# Altium schematic sheet Sheet.Autolabor.SchDoc
size A4
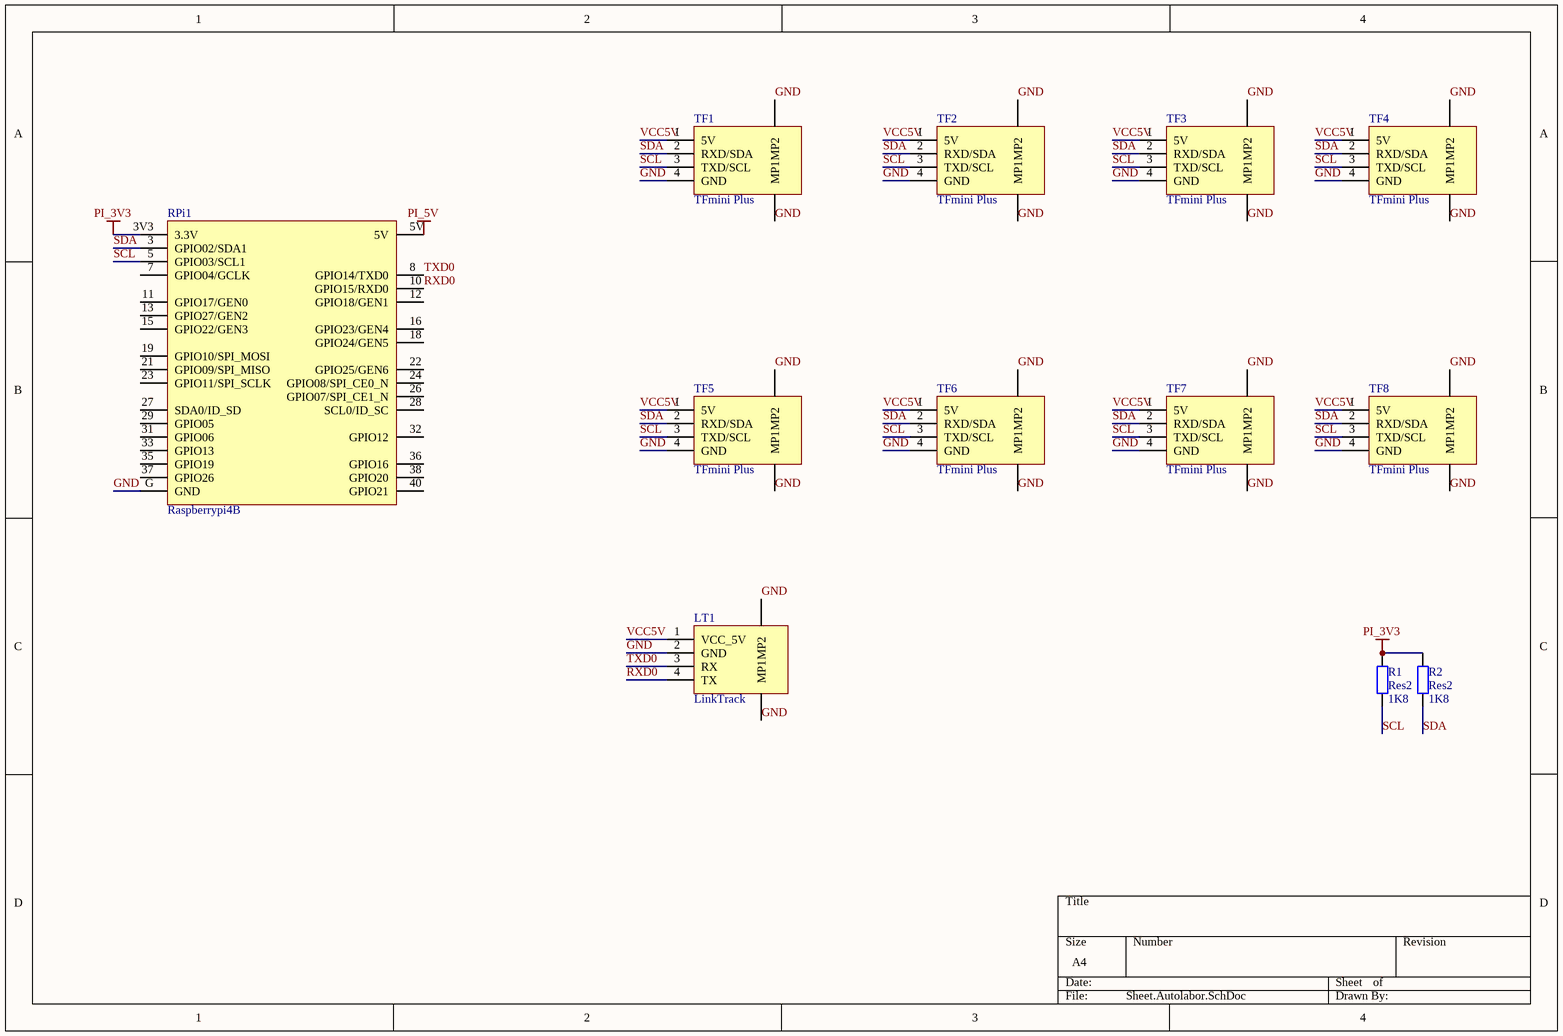
[diagram p0: Sheet.Autolabor.SchDoc]

## Parts
LT1  LinkTrack  [GH1.25-S-4P-small]
R1  Res2  value 1K8  [6-0805_L]
R2  Res2  value 1K8  [6-0805_L]
RPi1  Raspberrypi4B  [RPi-40p-small]
TF1  TFmini Plus  [GH1.25-S-4P-small]
TF2  TFmini Plus  [GH1.25-S-4P-small]
TF3  TFmini Plus  [GH1.25-S-4P-small]
TF4  TFmini Plus  [GH1.25-S-4P-small]
TF5  TFmini Plus  [GH1.25-S-4P-small]
TF6  TFmini Plus  [GH1.25-S-4P-small]
TF7  TFmini Plus  [GH1.25-S-4P-small]
TF8  TFmini Plus  [GH1.25-S-4P-small]

## Nets
PI_3V3: R1.2 R2.2 RPi1.3V3(3.3V)
PI_5V: RPi1.5V
GND: LT1.2(GND) LT1.MP1 LT1.MP2 RPi1.G(GND) TF1.4(GND) TF1.MP1 TF1.MP2 TF2.4(GND) TF2.MP1 TF2.MP2 TF3.4(GND) TF3.MP1 TF3.MP2 TF4.4(GND) TF4.MP1 TF4.MP2 TF5.4(GND) TF5.MP1 TF5.MP2 TF6.4(GND) TF6.MP1 TF6.MP2 TF7.4(GND) TF7.MP1 TF7.MP2 TF8.4(GND) TF8.MP1 TF8.MP2
RXD0: LT1.4(TX) RPi1.10(GPIO15/RXD0)
SCL: R1.1 RPi1.5(GPIO03/SCL1) TF1.3(TXD/SCL) TF2.3(TXD/SCL) TF3.3(TXD/SCL) TF4.3(TXD/SCL) TF5.3(TXD/SCL) TF6.3(TXD/SCL) TF7.3(TXD/SCL) TF8.3(TXD/SCL)
SDA: R2.1 RPi1.3(GPIO02/SDA1) TF1.2(RXD/SDA) TF2.2(RXD/SDA) TF3.2(RXD/SDA) TF4.2(RXD/SDA) TF5.2(RXD/SDA) TF6.2(RXD/SDA) TF7.2(RXD/SDA) TF8.2(RXD/SDA)
TXD0: LT1.3(RX) RPi1.8(GPIO14/TXD0)
VCC5V: LT1.1(VCC_5V) TF1.1(5V) TF2.1(5V) TF3.1(5V) TF4.1(5V) TF5.1(5V) TF6.1(5V) TF7.1(5V) TF8.1(5V)

Not connected (* = marked no-connect by the designer): RPi1 7(GPIO04/GCLK) 11(GPIO17/GEN0) 12(GPIO18/GEN1) 13(GPIO27/GEN2) 15(GPIO22/GEN3) 16(GPIO23/GEN4) 18(GPIO24/GEN5) 19(GPIO10/SPI_MOSI) 21(GPIO09/SPI_MISO) 22(GPIO25/GEN6) 23(GPIO11/SPI_SCLK) 24(GPIO08/SPI_CE0_N) 26(GPIO07/SPI_CE1_N) 27(SDA0/ID_SD) 28(SCL0/ID_SC) 29(GPIO05) 31(GPIO06) 32(GPIO12) 33(GPIO13) 35(GPIO19) 36(GPIO16) 37(GPIO26) 38(GPIO20) 40(GPIO21)

## Library data of the parts
R1 R2 = Res2: Resistor; Published: 8-Jun-2000; LatestRevisionDate: 17-Jul-2002; LatestRevisionNote: Re-released for DXP Platform.; PackageReference: AXIAL-0.4; Publisher: Altium Limited; PackageDescription: Axial Device, Thru-Hole; 2 Leads; 0.4 in Pin Spacing
RPi1 = Raspberrypi4B_EX
TF1-TF8 = TF